# Altium schematic sheet DI_DO.SchDoc
size A4; SheetNumber: 5; SheetTotal: 8
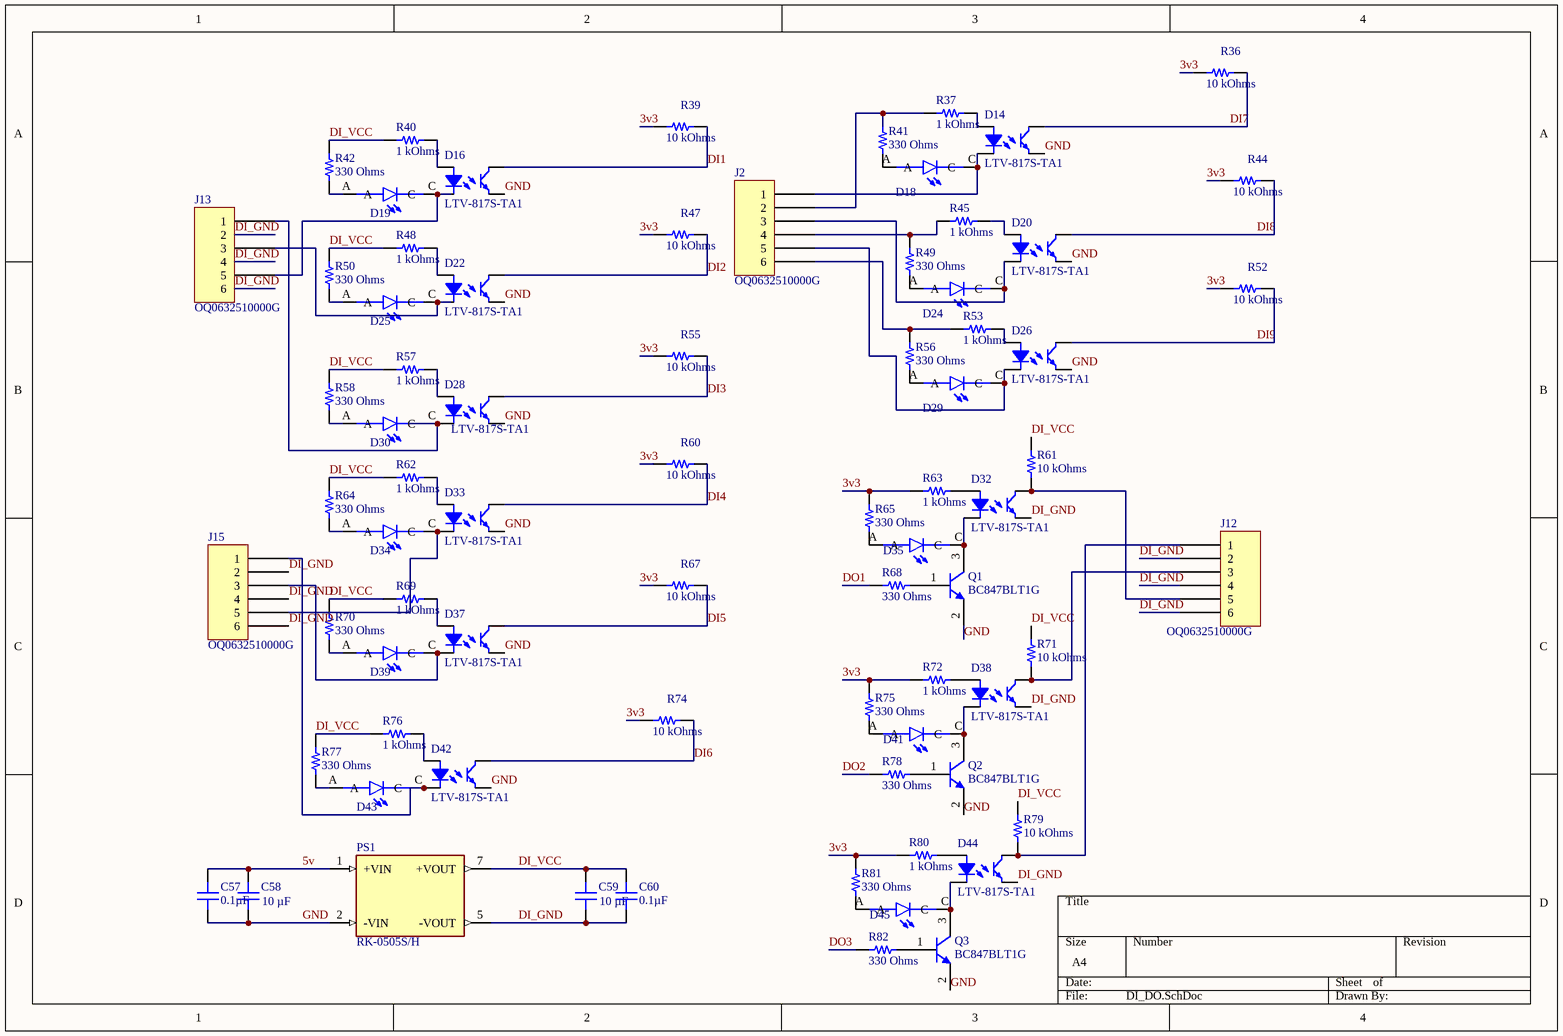
[diagram p0: DI_DO.SchDoc]

## Parts
C57  Capacitance: 0.1µF  [CAP 0805_2012]  (hidden comment: 1µF)
C58  10 µF  [CAP 1206_3216 - 0.8MM]
C59  10 µF  [CAP 1206_3216 - 0.8MM]
C60  Capacitance: 0.1µF  [CAP 0805_2012]  (hidden comment: 1µF)
D14  LTV-817S-TA1  [LITEON LTV-817]
D16  LTV-817S-TA1  [LITEON LTV-817]
D18  597-3305-607F  [LEDC2012X70N]  (value not drawn)
D19  597-3305-607F  [LEDC2012X70N]  (value not drawn)
D20  LTV-817S-TA1  [LITEON LTV-817]
D22  LTV-817S-TA1  [LITEON LTV-817]
D24  597-3305-607F  [LEDC2012X70N]  (value not drawn)
D25  597-3305-607F  [LEDC2012X70N]  (value not drawn)
D26  LTV-817S-TA1  [LITEON LTV-817]
D28  LTV-817S-TA1  [LITEON LTV-817]
D29  597-3305-607F  [LEDC2012X70N]  (value not drawn)
D30  597-3305-607F  [LEDC2012X70N]  (value not drawn)
D32  LTV-817S-TA1  [LITEON LTV-817]
D33  LTV-817S-TA1  [LITEON LTV-817]
D34  597-3305-607F  [LEDC2012X70N]  (value not drawn)
D35  597-3305-607F  [LEDC2012X70N]  (value not drawn)
D37  LTV-817S-TA1  [LITEON LTV-817]
D38  LTV-817S-TA1  [LITEON LTV-817]
D39  597-3305-607F  [LEDC2012X70N]  (value not drawn)
D41  597-3305-607F  [LEDC2012X70N]  (value not drawn)
D42  LTV-817S-TA1  [LITEON LTV-817]
D43  597-3305-607F  [LEDC2012X70N]  (value not drawn)
D44  LTV-817S-TA1  [LITEON LTV-817]
D45  597-3305-607F  [LEDC2012X70N]  (value not drawn)
J2  OQ0632510000G  [FCI 06-381-6PIN]
J12  OQ0632510000G  [FCI 06-381-6PIN]
J13  OQ0632510000G  [FCI 06-381-6PIN]
J15  OQ0632510000G  [FCI 06-381-6PIN]
PS1  RK-0505S/H  [CONV_RK-0505S/H]
Q1  BC847BLT1G  [ON SEMI SOT-23-3]
Q2  BC847BLT1G  [ON SEMI SOT-23-3]
Q3  BC847BLT1G  [ON SEMI SOT-23-3]
R36  10 kOhms  [RES 0805_2012]
R37  1 kOhms  [RES 0805_2012]
R39  10 kOhms  [RES 0805_2012]
R40  1 kOhms  [RES 0805_2012]
R41  330 Ohms  [RES 0805_2012]
R42  330 Ohms  [RES 0805_2012]
R44  10 kOhms  [RES 0805_2012]
R45  1 kOhms  [RES 0805_2012]
R47  10 kOhms  [RES 0805_2012]
R48  1 kOhms  [RES 0805_2012]
R49  330 Ohms  [RES 0805_2012]
R50  330 Ohms  [RES 0805_2012]
R52  10 kOhms  [RES 0805_2012]
R53  1 kOhms  [RES 0805_2012]
R55  10 kOhms  [RES 0805_2012]
R56  330 Ohms  [RES 0805_2012]
R57  1 kOhms  [RES 0805_2012]
R58  330 Ohms  [RES 0805_2012]
R60  10 kOhms  [RES 0805_2012]
R61  10 kOhms  [RES 0805_2012]
R62  1 kOhms  [RES 0805_2012]
R63  1 kOhms  [RES 0805_2012]
R64  330 Ohms  [RES 0805_2012]
R65  330 Ohms  [RES 0805_2012]
R67  10 kOhms  [RES 0805_2012]
R68  330 Ohms  [RES 0805_2012]
R69  1 kOhms  [RES 0805_2012]
R70  330 Ohms  [RES 0805_2012]
R71  10 kOhms  [RES 0805_2012]
R72  1 kOhms  [RES 0805_2012]
R74  10 kOhms  [RES 0805_2012]
R75  330 Ohms  [RES 0805_2012]
R76  1 kOhms  [RES 0805_2012]
R77  330 Ohms  [RES 0805_2012]
R78  330 Ohms  [RES 0805_2012]
R79  10 kOhms  [RES 0805_2012]
R80  1 kOhms  [RES 0805_2012]
R81  330 Ohms  [RES 0805_2012]
R82  330 Ohms  [RES 0805_2012]

## Nets
3v3: R36.2 R39.2 R44.2 R47.2 R52.2 R55.2 R60.2 R63.1 R65.1 R67.2 R72.1 R74.2 R75.1 R80.1 R81.1
5v: C57.2 C58.2 PS1.1(+VIN)
DI1: D16.4 R39.1
DI2: D22.4 R47.1
DI3: D28.4 R55.1
DI4: D33.4 R60.1
DI5: D37.4 R67.1
DI6: D42.4 R74.1
DI7: D14.4 R36.1
DI8: D20.4 R44.1
DI9: D26.4 R52.1
DI_GND: C59.1 C60.1 D32.3 D38.3 D44.3 J12.2 J12.4 J12.6 J13.2 J13.4 J13.6 J15.2 J15.4 J15.6 PS1.5(-VOUT)
DI_VCC: C59.2 C60.2 PS1.7(+VOUT) R40.1 R42.2 R48.1 R50.2 R57.1 R58.2 R61.1 R62.1 R64.2 R69.1 R70.2 R71.1 R76.1 R77.2 R79.1
DO1: R68.1
DO2: R78.1
DO3: R82.1
GND: C57.1 C58.1 D14.3 D16.3 D20.3 D22.3 D26.3 D28.3 D33.3 D37.3 D42.3 PS1.2(-VIN) Q1.2(E) Q2.2(E) Q3.2(E)
NetD14_1: D14.1 R37.2
NetD14_2: D14.2 D18.C J2.1
NetD16_1: D16.1 R40.2
NetD16_2: D16.2 D19.C J13.5
NetD18_A: D18.A R41.2
NetD19_A: D19.A R42.1
NetD20_1: D20.1 R45.2
NetD20_2: D20.2 D24.C J2.3
NetD22_1: D22.1 R48.2
NetD22_2: D22.2 D25.C J13.3
NetD24_A: D24.A R49.2
NetD25_A: D25.A R50.1
NetD26_1: D26.1 R53.2
NetD26_2: D26.2 D29.C J2.5
NetD28_1: D28.1 R57.2
NetD28_2: D28.2 D30.C J13.1
NetD29_A: D29.A R56.2
NetD30_A: D30.A R58.1
NetD32_1: D32.1 R63.2
NetD32_2: D32.2 D35.C Q1.3(C)
NetD32_4: D32.4 J12.5 R61.2
NetD33_1: D33.1 R62.2
NetD33_2: D33.2 D34.C J15.5
NetD34_A: D34.A R64.1
NetD35_A: D35.A R65.2
NetD37_1: D37.1 R69.2
NetD37_2: D37.2 D39.C J15.3
NetD38_1: D38.1 R72.2
NetD38_2: D38.2 D41.C Q2.3(C)
NetD38_4: D38.4 J12.3 R71.2
NetD39_A: D39.A R70.1
NetD41_A: D41.A R75.2
NetD42_1: D42.1 R76.2
NetD42_2: D42.2 D43.C J15.1
NetD43_A: D43.A R77.1
NetD44_1: D44.1 R80.2
NetD44_2: D44.2 D45.C Q3.3(C)
NetD44_4: D44.4 J12.1 R79.2
NetD45_A: D45.A R81.2
NetJ2_2: J2.2 R37.1 R41.1
NetJ2_4: J2.4 R45.1 R49.1
NetJ2_6: J2.6 R53.1 R56.1
NetQ1_1: Q1.1(B) R68.2
NetQ2_1: Q2.1(B) R78.2
NetQ3_1: Q3.1(B) R82.2

## Library data of the parts
C57 C60 = 0805ZC105KAT4A: CAP CER 1UF 10V X7R 0805; manufacturer: AVX Corporation; Tolerance: ±10%; Part Number: 0805ZC105KAT4A; Applications: General Purpose; componentlink1description: Datasheet; componentlink1url: http://datasheets.avx.com/X7RDielectric.pdf; componentlink2description: DigiKey Link; componentlink2url: http://digikey.com/product-detail/en/avx-corporation/0805ZC105KAT4A/478-7604-1-ND/7536237; Device Package: 0805 (2012 Metric); lastupdated: 02-09-2020 1.04.40 AM; Lifecycle Status: Active; Minimum Order: 1; Mounting Type: Surface Mount, MLCC; Operating Temperature: -55°C ~ 125°C; Package / Case: 0805 (2012 Metric); packaging: TapeAndReel; partid: 3500; Part Status: Active; price: 0.17; series: -; Size / Dimension: 0.079" L x 0.049" W (2.00mm x 1.25mm); Supplier 1: DigiKey; Supplier Part Number 1: 478-7604-1-ND; Temperature Coefficient: X7R; Thickness (Max): 0.037" (0.94mm); value: 1µF; Voltage - Rated: 10V
C58 C59 = EMK316BJ106MD-T: CAP CER 10UF 16V X5R 1206; manufacturer: Taiyo Yuden; Tolerance: ±20%; Part Number: EMK316BJ106MD-T; Capacitance: 10 µF; Applications: SMPS Filtering; componentlink1description: Datasheet; componentlink1url: http://www.yuden.co.jp/productdata/catalog/mlcc06_e.pdf; componentlink2description: DigiKey Link; componentlink2url: https://www.digikey.com/en/products/detail/taiyo-yuden/EMK316BJ106MD-T/6563474; Device Package: 1206 (3216 Metric); lastupdated: 04-06-2024 7.10.41 PM; Lifecycle Status: Active; Minimum Order: 1; Mounting Type: Surface Mount, MLCC; Operating Temperature: -55°C ~ 85°C; Package / Case: 1206 (3216 Metric); packaging: TapeAndReel; partid: 18996; Part Status: Active; price: 0.04; series: M; Size / Dimension: 0.126" L x 0.063" W (3.20mm x 1.60mm); Supplier 1: DigiKey; Supplier Part Number 1: 587-4881-1-ND; Temperature Coefficient: X5R; Thickness (Max): 0.037" (0.95mm); value: 10 µF; Voltage - Rated: 16V
D14 D16 D20 D22 D26 D28 D32 D33 D37 D38 D42 D44 = LTV-817S-TA1: OPTOISOLATR 5KV TRANSISTOR 4-SMD; Manufacturer: Lite-On Inc.; Current - DC Forward (If) (Max): 50mA; Current Transfer Ratio (Max): 600% @ 5mA; Current Transfer Ratio (Min): 50% @ 5mA; Input Type: DC; Number of Channels: 1; Rise / Fall Time (Typ): 4µs, 3µs; Vce Saturation (Max): 200mV; Voltage - Forward (Vf) (Typ): 1.2V; Voltage - Isolation: 5000Vrms; Voltage - Output (Max): 35V; Part Number: LTV-817S-TA1; ComponentLink1Description: Datasheet; ComponentLink1URL: http://optoelectronics.liteon.com/upload/download/DS-70-96-0016/LTV-8X7%20series%20201610%20.pdf; ComponentLink2Description: DigiKey Link; ComponentLink2URL: http://digikey.com/product-detail/en/lite-on-inc/LTV-817S-TA1/160-1893-1-ND/3306757; Current - Output / Channel: 50mA; Device Package: 4-SMD, Gull Wing; LastUpdated: 12-01-2020 9.58.48 PM; Lifecycle Status: Active; Minimum Order: 1; Mounting Type: Surface Mount; Operating Temperature: -30°C ~ 110°C; Output Type: Transistor; Package / Case: 4-SMD, Gull Wing; Packaging: TapeAndReel; Part Status: Active; Price: 0.12; Series: -; Supplier 1: DigiKey; Supplier Part Number 1: 160-1893-1-ND; Supplier Device Package: 4-SMD
D18 D19 D24 D25 D29 D30 D34 D35 D39 D41 D43 D45 = 597-3305-607F: LED Uni-Color Green 4-Pin Chip 0805 T/R; Availability: Unavailable; Value: *; Price: None; MP: 597-3305-607F; Package: None
J2 J12 J13 J15 = OQ0632510000G: TERM BLOCK HDR 6POS 90DEG 3.81MM; Manufacturer: Amphenol Anytek; Current - UL: 10A; Header Orientation: 90°, Right Angle; Number of Levels: 1; Number of Positions: 6; Pitch: 0.150" (3.81mm); Voltage - UL: 300V; Part Number: OQ0632510000G; Color: Green; ComponentLink1Description: Datasheet; ComponentLink1URL: http://portal.fciconnect.com/Comergent//fci/drawing/oqxx32x100j0g.pdf; ComponentLink2Description: DigiKey Link; ComponentLink2URL: //digikey.com/product-detail/en/amphenol-anytek/OQ0632510000G/609-3823-ND/2261282; Contact Mating Finish: Tin; LastUpdated: 16-12-2019 7.16.11 PM; Lifecycle Status: 0; Minimum Order: 1; Mounting Type: Through Hole; Operating Temperature: -40°C ~ 115°C; Packaging: Bulk; Part Status: Active; Positions Per Level: 6; Price: 0.80; Series: 06-381; Supplier 1: DigiKey; Supplier Part Number 1: 609-3823-ND; Termination Style: Solder; Type: Header, Male Pins, Shrouded (4 Side)
PS1 = RK-0505S/H: DC/DC Converter, 1 Watt, SIP7, Single Output; MF: {'manufacturer': u'Recom Power'}; Package: None; Price: None; Value: *; MP: RK-0505S/H; Availability: Unavailable
Q1-Q3 = BC847BLT1G: TRANS NPN 45V 0.1A SOT23; Manufacturer: ON Semiconductor; Current - Collector Cutoff (Max): 15nA (ICBO); Current - Collector (Ic) (Max): 100mA; DC Current Gain (hFE) (Min) @ Ic, Vce: 200 @ 2mA, 5V; Frequency - Transition: 100MHz; Power - Max: 300mW; Vce Saturation (Max) @ Ib, Ic: 600mV @ 5mA, 100mA; Part Number: BC847BLT1G; ComponentLink1Description: Datasheet; ComponentLink1URL: http://www.onsemi.com/pub/Collateral/BC846ALT1-D.PDF; ComponentLink2Description: DigiKey Link; ComponentLink2URL: http://digikey.com/product-detail/en/on-semiconductor/BC847BLT1G/BC847BLT1GOSCT-ND/917834; LastUpdated: 29-03-2026 8.43.49 PM; Lifecycle Status: Active; Minimum Order: 1; Mounting Type: Surface Mount; Operating Temperature: -55°C ~ 150°C (TJ); Package / Case: TO-236-3, SC-59, SOT-23-3; Packaging: TapeAndReel; PartId: 246; Part Status: Active; Price: 0.02; Series: -; Supplier 1: DigiKey; Supplier Part Number 1: BC847BLT1GOSCT-ND; Supplier Device Package: SOT-23-3 (TO-236); Transistor Type: NPN; Voltage - Collector Emitter Breakdown (Max): 45V
R36 R39 R44 R47 R52 R55 R60 R61 R67 R71 R74 R79 = ESR10EZPF1002: RES SMD 10K OHM 1% 0.4W 0805; Manufacturer: Rohm Semiconductor; Power (Watts): 0.4W, 2/5W; Temperature Coefficient: ±100ppm/°C; Part Number: ESR10EZPF1002; Value: 10 kOhms; ComponentLink1Description: Datasheet; ComponentLink1URL: https://www.rohm.com/datasheet/ESR01MZPF/esr-e; ComponentLink2Description: DigiKey Link; ComponentLink2URL: https://www.digikey.com/en/products/detail/rohm-semiconductor/ESR10EZPF1002/1983481; Composition: Thick Film; Device Package: 0805 (2012 Metric); Features: Automotive AEC-Q200, Pulse Withstanding; Height - Seated (Max): 0.026" (0.65mm); LastUpdated: 08-02-2024 9.02.37 PM; Lifecycle Status: Active; Minimum Order: 1; Number of Terminations: 2; Operating Temperature: -55°C ~ 155°C; Package / Case: 0805 (2012 Metric); Packaging: TapeAndReel; PartId: 28034; Part Status: Active; Price: 0.02; Ratings: AEC-Q200; Resistance: 10 kOhms; Series: ESR; Size / Dimension: 0.079" L x 0.049" W (2.00mm x 1.25mm); Supplier 1: DigiKey; Supplier Part Number 1: RHM10.0KAECT-ND; Supplier Device Package: 0805; Tolerance: ±1%
R37 R40 R45 R48 R53 R57 R62 R63 R69 R72 R76 R80 = ESR10EZPF1001: RES SMD 1K OHM 1% 0.4W 0805; Manufacturer: Rohm Semiconductor; Power (Watts): 0.4W, 2/5W; Temperature Coefficient: ±100ppm/°C; Part Number: ESR10EZPF1001; Value: 1 kOhms; ComponentLink1Description: Datasheet; ComponentLink1URL: https://www.rohm.com/datasheet/ESR01MZPF/esr-e; ComponentLink2Description: DigiKey Link; ComponentLink2URL: https://www.digikey.com/en/products/detail/rohm-semiconductor/ESR10EZPF1001/1983480; Composition: Thick Film; Device Package: 0805 (2012 Metric); Features: Automotive AEC-Q200, Pulse Withstanding; Height - Seated (Max): 0.026" (0.65mm); LastUpdated: 08-02-2024 9.02.37 PM; Lifecycle Status: Active; Minimum Order: 1; Number of Terminations: 2; Operating Temperature: -55°C ~ 155°C; Package / Case: 0805 (2012 Metric); Packaging: TapeAndReel; PartId: 28032; Part Status: Active; Price: 0.02; Ratings: AEC-Q200; Resistance: 1 kOhms; Series: ESR; Size / Dimension: 0.079" L x 0.049" W (2.00mm x 1.25mm); Supplier 1: DigiKey; Supplier Part Number 1: RHM1.00KAECT-ND; Supplier Device Package: 0805; Tolerance: ±1%
R41 R42 R49 R50 R56 R58 R64 R65 R68 R70 R75 R77 R78 R81 R82 = CRCW0805330RFKEAHP: RES SMD 330 OHM 1% 1/2W 0805; Manufacturer: Vishay Dale; Power (Watts): 0.5W, 1/2W; Temperature Coefficient: ±100ppm/°C; Part Number: CRCW0805330RFKEAHP; Value: 330 Ohms; ComponentLink1Description: Datasheet; ComponentLink1URL: http://www.vishay.com/docs/20043/crcwhpe3.pdf; ComponentLink2Description: DigiKey Link; ComponentLink2URL: https://www.digikey.com/en/products/detail/vishay-dale/CRCW0805330RFKEAHP/2226912; Composition: Thick Film; Device Package: 0805 (2012 Metric); Features: Automotive AEC-Q200, Pulse Withstanding; Height - Seated (Max): 0.020" (0.50mm); LastUpdated: 08-02-2024 9.02.28 PM; Lifecycle Status: Active; Minimum Order: 1; Number of Terminations: 2; Operating Temperature: -55°C ~ 155°C; Package / Case: 0805 (2012 Metric); Packaging: TapeAndReel; PartId: 30364; Part Status: Active; Price: 0.02; Ratings: AEC-Q200; Resistance: 330 Ohms; Series: CRCW-HP; Size / Dimension: 0.079" L x 0.049" W (2.00mm x 1.25mm); Supplier 1: DigiKey; Supplier Part Number 1: 541-330TCT-ND; Supplier Device Package: 0805; Tolerance: ±1%